# EAGLE design 2s AmplifierStage (EAGLE 8.2.2)
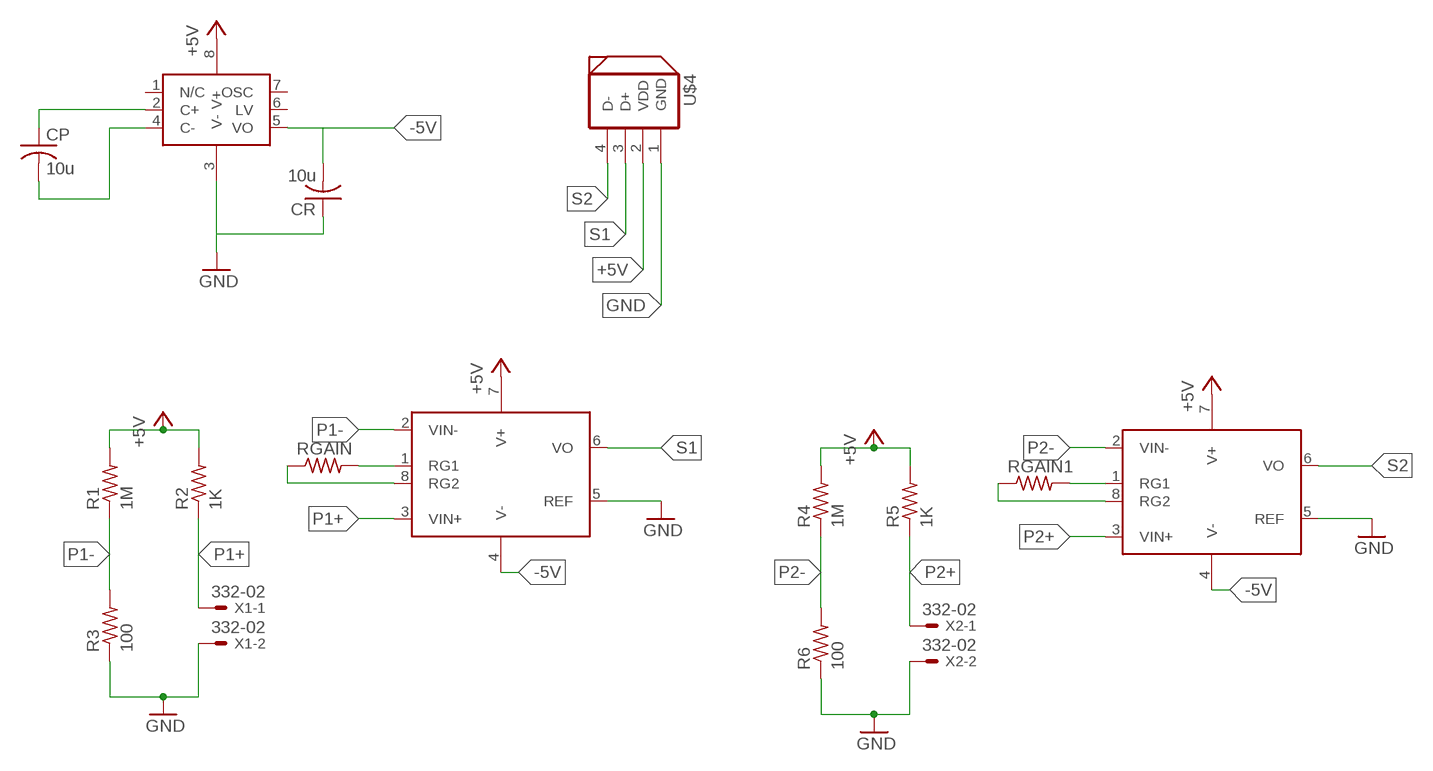
[diagram p0: schematic, sheet 1]

## Parts
CP  10u  C-US025-050X050  [C025-050X050]
CR  10u  C-US025-050X050  [C025-050X050]
R1  1M  R-US_0207/10  [0207/10]
R2  1K  R-US_0207/10  [0207/10]
R3  100  R-US_0207/10  [0207/10]
R4  1M  R-US_0207/10  [0207/10]
R5  1K  R-US_0207/10  [0207/10]
R6  100  R-US_0207/10  [0207/10]
RGAIN  R-US_0207/10  [0207/10]
RGAIN1  R-US_0207/10  [0207/10]
U$1  LMC7660DI  [DIL08]
U$2  INA128PDIP8  [DIL08]
U$3  INA128PDIP8  [DIL08]
U$4  DYNAMIXEL_RS485  [DYNAMIXEL_SPOX_04]
X1  332-02  [332-02]
X2  332-02  [332-02]

## Nets
+5V: R1.2 R2.2 R4.2 R5.2 U$1.8(V+) U$2.7(V+) U$3.7(V+) U$4.2(VDD)
-5V: CR.2 U$1.5(VO) U$2.4(V-) U$3.4(V-)
GND: CR.1 R3.1 R6.1 U$1.3(V-) U$2.5(REF) U$3.5(REF) U$4.1(GND) X1.2 X2.2
N$1: RGAIN1.2 U$3.1(RG1)
N$2: RGAIN1.1 U$3.8(RG2)
N$3: CP.1 U$1.2(C+)
N$4: CP.2 U$1.4(C-)
N$5: RGAIN.2 U$2.1(RG1)
N$6: RGAIN.1 U$2.8(RG2)
P1+: R2.1 U$2.3(VIN+) X1.1
P1-: R1.1 R3.2 U$2.2(VIN-)
P2+: R5.1 U$3.3(VIN+) X2.1
P2-: R4.1 R6.2 U$3.2(VIN-)
S1: U$2.6(VO) U$4.3(D+)
S2: U$3.6(VO) U$4.4(D-)
Unconnected: U$1.1(N/C) U$1.6(LV) U$1.7(OSC)

## Library data of the parts
CP CR = resistor:C-US: CAPACITOR, American symbol
R1-R6 RGAIN RGAIN1 = resistor:R-US_: RESISTOR, American symbol
U$1 = uchile_robotics_eagle_lib:LMC7660
U$2 U$3 = uchile_robotics_eagle_lib:INA128P
U$4 = uchile_robotics_eagle_lib:DYNAMIXEL_RS485: Dynamixel RS-485 Connector Molex LLC SPOX 4 Male connector Digikey code: WM18888-ND
X1 X2 = con-garry:332-02: 2 Pin - 2mm Dual Row Source: www.mpe-connector.de / garry_shortform_2012.pdf

## Board
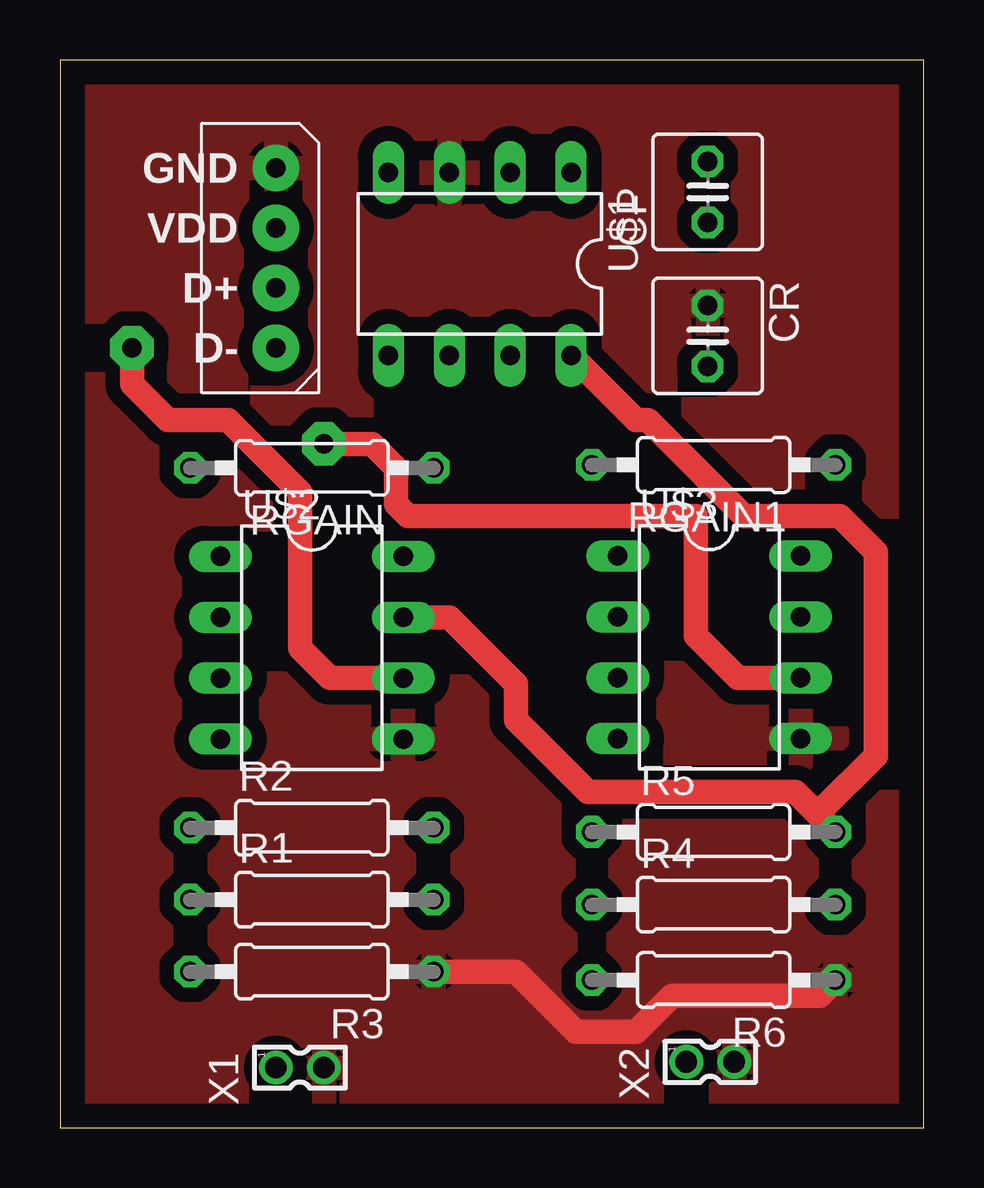
[diagram p1: board, top side]
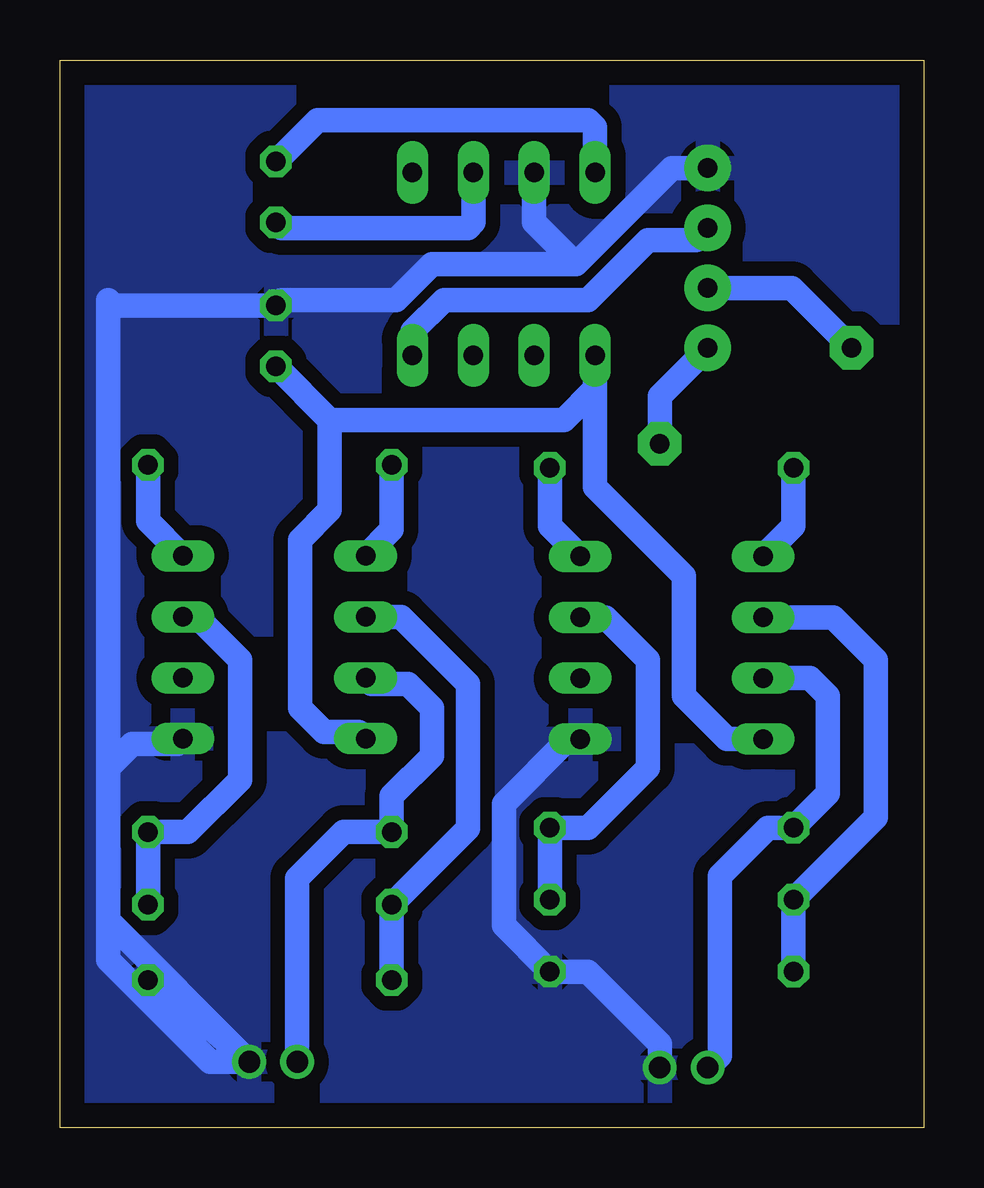
[diagram p2: board, bottom side, seen from below]

Size 36 x 44.5 mm. Coordinates in mm from the lower left corner, seen from the top.
Outline: 0,0 36,0 36,44.5 0,44.5 0,0
Copper layers (1*16): Top 0.035mm / dielectric 1.5mm / Bottom 0.035mm
Design rules "default": minimum track width 6mil, minimum drill 0.35mm, track to track 6mil, track to pad 6mil, pad to pad 6mil, via to via 6mil, smd to smd 6mil, copper to edge 40mil, drill to drill 6mil, minimum pad ring 10mil, minimum via ring 8mil, stop-mask expansion 4mil, vias tented up to drill 0mil, thermal gap 10mil

### Footprints (pad centres in the part's own frame; a part is rotated, then mirrored left to right if it is on the bottom)
C025-050X050 = drill 0.813 octagon: 1 -1.27,0; 2 1.27,0
0207/10 = drill 0.813 octagon: 1 -5.08,0; 2 5.08,0
DIL08 = drill 0.813 long: 1 -3.81,-3.81; 2 -1.27,-3.81; 3 1.27,-3.81; 4 3.81,-3.81; 5 3.81,3.81; 6 1.27,3.81; 7 -1.27,3.81; 8 -3.81,3.81
DYNAMIXEL_SPOX_04 = drill 0.8 pad 1.93: 1 0,0; 2 2.5,0; 3 5,0; 4 7.5,0
332-02 = drill 0.9 pad 1.27: 1 0,-1; 2 0,1

### Placement (x,y rotation side)
CP  27,39 90 top
CR  27,33 270 top
R1  10.5,9.5 0 top
R2  10.5,12.5 0 top
R3  10.5,6.5 180 top
R4  27.25,9.29 0 top
R5  27.25,12.32 0 top
R6  27.25,6.15 180 top
RGAIN  10.5,27.5 180 top
RGAIN1  27.25,27.62 180 top
U$1  17.5,36 180 top
U$2  10.5,20 270 top
U$3  27.07,20.02 270 top
U$4  9,40 270 top
X1  10,2.5 270 top
X2  27.11,2.74 270 top

### Tracks (layer width: path | path; a pad name or v marks a point on that pad's centre or on a via)
+5V
  Top 1.016: U$2.7 16.23,21.27 19,18.5 19,17 22,14 30.65,14 31.32,13.32 | 31.32,13.32 R5.2 | 31.32,13.32 31.82,13.32 34,15.5 34,24 32.5,25.5 28.5,25.5 24.5,29.5 24,29.5 U$1.8
  Bottom 1.016: R4.2 R5.2 30.68,12.32 28.5,14.5 28.5,19.5 30.29,21.29 U$3.7 | U$2.7 13.27,21.27 11.5,19.5 11.5,15 14,12.5 R2.2 R1.2 | U$4.2 9.5,37 11.5,37 14,34.5 20,34.5 21.31,33.19 U$1.8
-5V
  Bottom 1.016: U$2.4 8.19,16.19 10,18 10,23 13.69,26.69 U$1.5 13.69,30.81 15,29.5 24.77,29.5 | 24.77,29.5 CR.2 | 24.77,29.5 24.77,25.73 26,24.5 26,17.5 25,16.5 23.55,16.5 U$3.4
GND
  Top 1.016: R3.1 19,6.5 21.5,4 24,4 25.5,5.5 31.68,5.5 R6.1
  Bottom 1.016: R6.1 32.02,6.15 X2.2 | U$2.5 14.81,16.19 17.5,13.5 17.5,8.42 R3.1 14,6.5 11,3.5 X1.2 | X2.2 29.74,2.74 34,7 34,15 33,16 31.09,16 U$3.5 | U$4.1 10.5,40 14.5,36 | 14.5,36 16.23,37.73 U$1.3 | 14.5,36 20.5,36 22,34.5 26.77,34.5 CR.1 33.77,34.27 34,34.5 34,8.63 X2.2
  pour Top (isolate 0.61): 0,0 36,0 36,44.5 0,44.5
  pour Bottom (isolate 0.61): 0,0 36,0 36,44.5 0,44.5
N$1
  Bottom 1.016: RGAIN1.2 22.17,24.92 U$3.1
N$2
  Bottom 1.016: RGAIN1.1 32.33,25.28 U$3.8
N$3
  Bottom 1.016: CP.1 26.77,37.5 19,37.5 18.77,37.73 U$1.2
N$4
  Bottom 1.016: CP.2 25.27,42 14,42 13.69,41.69 U$1.4
N$5
  Bottom 1.016: RGAIN.2 5.42,25.08 U$2.1
N$6
  Bottom 1.016: RGAIN.1 15.58,25.08 U$2.8
P1+
  Bottom 1.016: X1.1 8.5,3 8.5,10.5 6.5,12.5 R2.1 4,13.92 4,18 4.73,18.73 U$2.3
P1-
  Bottom 1.016: R3.2 R1.1 2,12.92 2,19.5 3.77,21.27 U$2.2
P2+
  Bottom 1.016: U$3.3 23.01,18.5 21.5,18.5 20.5,17.5 20.5,15.5 22.17,13.83 R5.1 24.18,12.32 26.11,10.39 X2.1
P2-
  Bottom 1.016: R6.2 R4.1 19,12.46 19,18.5 21.79,21.29 U$3.2
S1  (via drill 0.8 pad 1.8)
  Top 1.016: U$2.6 11.27,18.73 10,20 10,26.5 7,29.5 4.5,29.5 3,31 v3,32.5
  Bottom 1.016: v3,32.5 5.5,35 U$4.3
S2  (via drill 0.8 pad 1.8)
  Top 1.016: 14,27.5 14,26 | 14,26 14.5,25.5 26.5,25.5 26.5,20.5 28.25,18.75 U$3.6 | 14,26 14,27.5 | 14,27.5 13,28.5 v11,28.5
  Bottom 1.016: U$4.4 11,30.5 v11,28.5